# Altium schematic sheet 4layer schematic.SchDoc: Power Bank   by Abdelrahman Ahmed (part 1 of 3)
size A2; Author: Abdelrahman Ahmed; DrawnBy: Abdelrahman Ahmed; Engineer: Abdelrahman Ahmed; Address3: Alexandria; Address4: Egypt; SheetNumber: 1; SheetTotal: 1
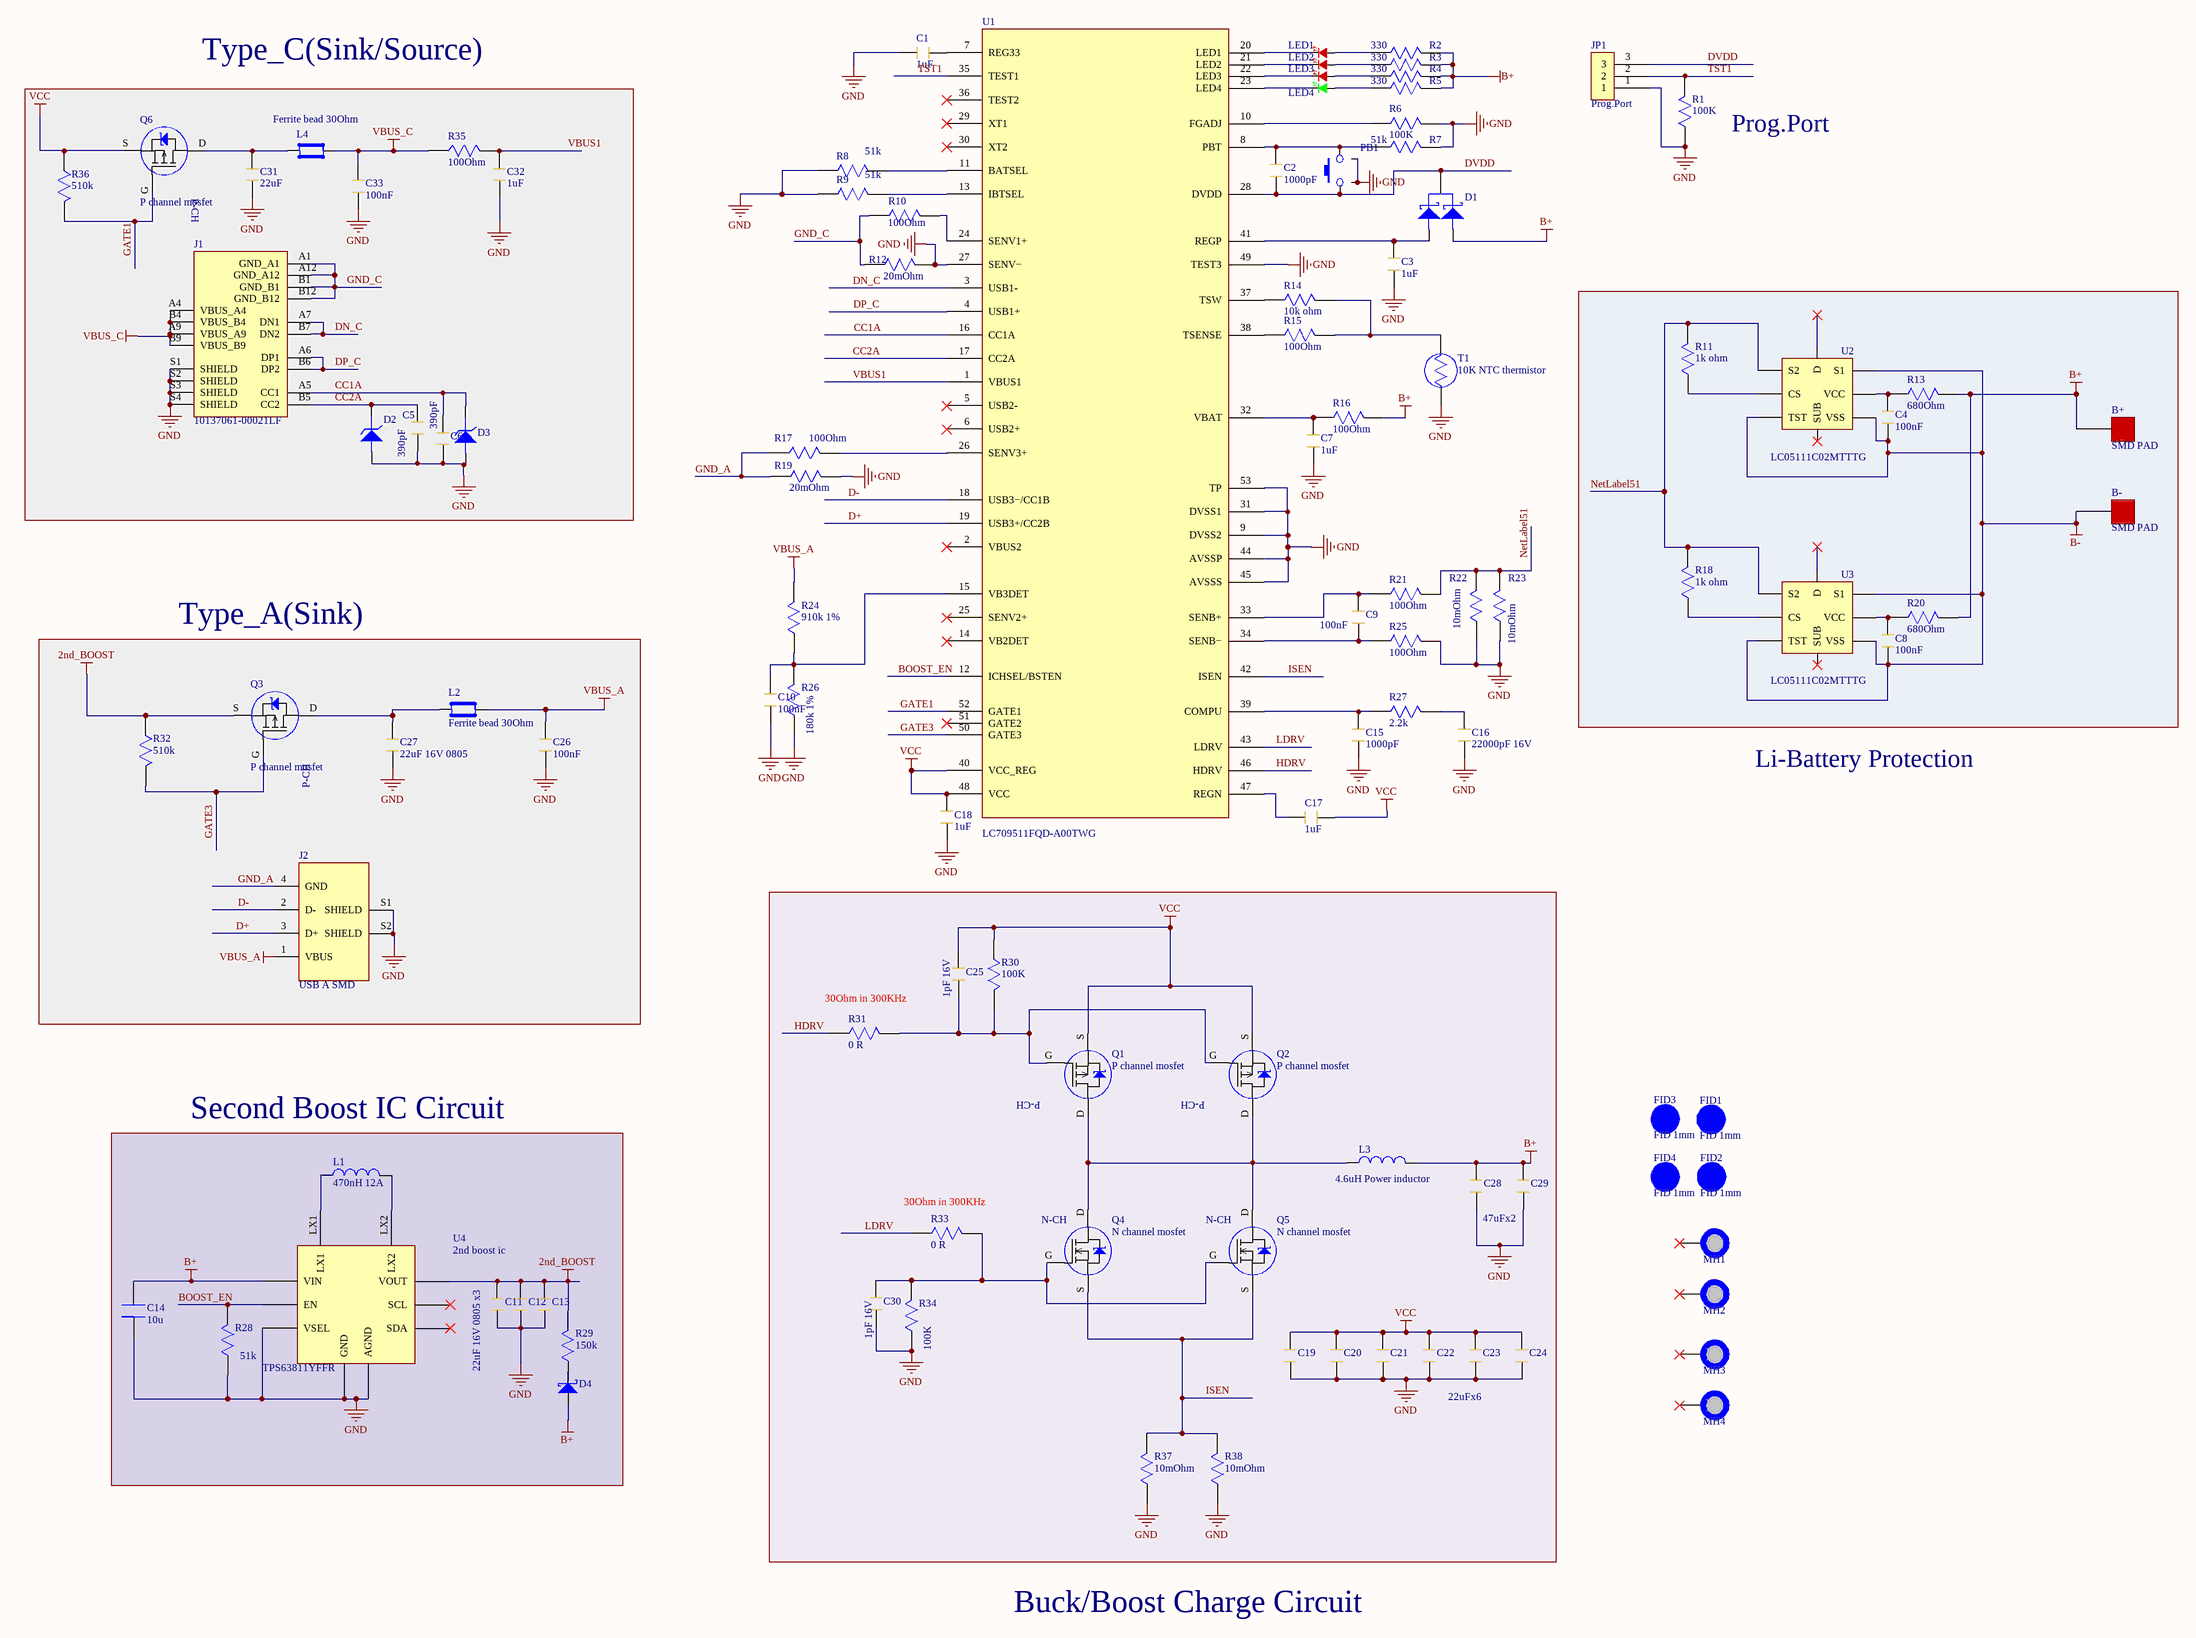
[diagram p0: 4layer schematic.SchDoc]

## Parts
B+  SMD PAD  [SMD PAD]
B-  SMD PAD  [SMD PAD]
C1  1uF  [R0603]
C2  1000pF  [C0402]
C3  1uF  [R0603]
C4  100nF  [C0402]
C5  390pF  [R0603]
C6  390pF  [R0603]
C7  1uF  [R0603]
C8  100nF  [C0402]
C9  100nF  [C0402]
C10  100nF  [C0402]
C11  22uF 16V 0805  [Cap 0805]  (value not drawn)
C12  22uF 16V 0805  [Cap 0805]  (value not drawn)
C13  22uF 16V 0805 x3  [Cap 0805]
C14  10u  [Cap 0805]
C15  1000pF  [C0402]
C16  22000pF 16V  [C0402]
C17  1uF  [R0603]
C18  1uF  [R0603]
C19  22uF 16V 0805  [Cap 0805]  (value not drawn)
C20  22uF 16V 0805  [Cap 0805]  (value not drawn)
C21  22uF 16V 0805  [Cap 0805]  (value not drawn)
C22  22uF 16V 0805  [Cap 0805]  (value not drawn)
C23  22uF 16V 0805  [Cap 0805]  (value not drawn)
C24  22uF 16V 0805  [Cap 0805]  (value not drawn)
C25  1pF 16V  [C0402]
C26  100nF  [Cap 0805]
C27  22uF 16V 0805  [Cap 0805]
C28  47uFx2  [C1210]
C29  47uF 16V  [C1210]  (value not drawn)
C30  1pF 16V  [C0402]
C31  22uF  [Cap 0805]
C32  1uF  [R0603]
C33  100nF  [Cap 0805]
D1  common cathode Schottkey  [3Pins schottkey]  (value not drawn)
D2  zener SOD532 5.1V 10mA  [Zener SOD532]  (value not drawn)
D3  zener SOD532 5.1V 10mA  [Zener SOD532]  (value not drawn)
D4  BAT54HT1G  [diode sfmntd]  (value not drawn)
FID1  FID 1mm  [FID]  (no BOM)
FID2  FID 1mm  [FID]  (no BOM)
FID3  FID 1mm  [FID]  (no BOM)
FID4  FID 1mm  [FID]  (no BOM)
J1  10137061-00021LF  [PCBComponent_1]
J2  USB A SMD  [692122030100]
JP1  Prog.Port  [HDR Male 1x3]
L1  470nH 12A  [inductor 470nH]
L2  Ferrite bead 30Ohm  [R0805]
L3  4.6uH Power inductor  [inductor mouser]
L4  Ferrite bead 30Ohm  [R0805]
LED1  RED SMD  [ORNG LED SMD 1206]  (value not drawn)
LED2  RED SMD  [ORNG LED SMD 1206]  (value not drawn)
LED3  RED SMD  [ORNG LED SMD 1206]  (value not drawn)
LED4  GRN SMD  [GRN SMD LED]  (value not drawn)
MH1  Mount holes  [MH]  (value not drawn)  (no BOM)
MH2  Mount holes  [MH]  (value not drawn)  (no BOM)
MH3  MH. not plated  [MH. not plated]  (value not drawn)  (no BOM)
MH4  MH. not plated  [MH. not plated]  (value not drawn)  (no BOM)
PB1  FSMRA4JH04  [PB Right angle through hole]  (value not drawn)
Q1  P channel mosfet  [ECH8310-TL-H]
Q2  P channel mosfet  [ECH8310-TL-H]
Q3  P channel mosfet  [ECH8310-TL-H]
Q4  N channel mosfet  [Power mosfet on semi]
Q5  N channel mosfet  [Power mosfet on semi]
Q6  P channel mosfet  [ECH8310-TL-H]
R1  100K  [R0805]
R2  330  [R0805]
R3  330  [R0805]
R4  330  [R0805]
R5  330  [R0805]
R6  100K  [R0805]
R7  51k  [R0805]
R8  51k  [R0805]
R9  51k  [R0805]
R10  100Ohm  [R0603]
R11  1k ohm  [R0805]
R12  20mOhm  [R1206]
R13  680Ohm  [R0805]
R14  10k ohm  [R0805]
R15  100Ohm  [R0603]
R16  100Ohm  [R0603]
R17  100Ohm  [R0603]
R18  1k ohm  [R0805]
R19  20mOhm  [R1206]
R20  680Ohm  [R0805]
R21  100Ohm  [R0603]
R22  10mOhm  [R1206]
R23  10mOhm  [R1206]
R24  910k 1%  [R0805]
R25  100Ohm  [R0603]
R26  180k 1%  [R0805]
R27  2.2k  [R0805]
R28  51k  [R0805]
R29  150k  [R0805]
R30  100K  [R0805]
R31  0 R  [R0805]
R32  510k  [R0805]
R33  0 R  [R0805]
R34  100K  [R0805]
R35  100Ohm  [R0603]
R36  510k  [R0805]
R37  10mOhm  [R1206]
R38  10mOhm  [R1206]
T1  10K NTC thermistor  [thermistor]
U1  LC709511FQD-A00TWG  [Quad52]
U2  LC05111C02MTTTG  [LC05111C02MTTTGOSCT]
U3  LC05111C02MTTTG  [LC05111C02MTTTGOSCT]
U4  2nd boost ic  [BGA3x5]

## Blocks framed on the sheet
Type_A(Sink): C26 C27 J2 L2 Q3 R32
Second Boost IC Circuit: C11-C14 D4 L1 R28 R29 U4

## Nets
2nd_BOOST: C11.2 C12.2 C13.2 Q3.S R29.2 R32.2 U4.VOUT
B+: B+.1 C14.2 C28.2 C29.2 D1.2(ANODE2) D4.2(Anode) L3.2 R2.2 R3.2 R4.2 R5.2 R13.2 R16.2 R20.2 U4.VIN
B-: B-.1 C4.1 C8.1 U2.S1 U2.TST U2.VSS U3.S1 U3.TST U3.VSS
GND: C1.1 C3.1 C5.1 C6.1 C7.1 C10.1 C11.1 C12.1 C13.1 C14.1 C15.1 C16.1 C18.1 C19.1 C20.1 C21.1 C22.1 C23.1 C24.1 C26.1 C27.1 C28.1 C29.1 C30.1 C31.1 C32.1 C33.1 D2.2(A) D3.2(A) J1.S1(SHIELD) J1.S2(SHIELD) J1.S3(SHIELD) J1.S4(SHIELD) J2.S1(SHIELD) J2.S2(SHIELD) JP1.1 PB1.3(MH) PB1.4(MH) R1.2 R6.2 R7.2 R8.1 R9.1 R12.2 R19.2 R22.1 R23.1 R25.2 R26.1 R28.1 R34.1 R37.1 R38.1 T1.1 U1.9(DVSS2) U1.27(SENV−) U1.31(DVSS1) U1.44(AVSSP) U1.45(AVSSS) U1.49(TEST3) U1.53(TP) U4.AGND U4.GND U4.VSEL
VBUS_A: C26.2 J2.1(VBUS) L2.1 R24.2
VBUS_C: C33.2 J1.A4(VBUS_A4) J1.A9(VBUS_A9) J1.B4(VBUS_B4) J1.B9(VBUS_B9) L4.1 R35.2
VCC: C17.2 C18.2 C19.2 C20.2 C21.2 C22.2 C23.2 C24.2 C25.2 Q1.S Q2.S Q6.S R30.1 R36.2 U1.40(VCC_REG) U1.48(VCC)
BOOST_EN: R28.2 U1.12(ICHSEL/BSTEN) U4.EN
CC1A: C6.2 D3.1(K) J1.A5(CC1) U1.16(CC1A)
CC2A: C5.2 D2.1(K) J1.B5(CC2) U1.17(CC2A)
D+: J2.3(D+) U1.19(USB3+/CC2B)
D-: J2.2(D-) U1.18(USB3−/CC1B)
DN_C: J1.A7(DN1) J1.B7(DN2) U1.3(USB1-)
DP_C: J1.A6(DP1) J1.B6(DP2) U1.4(USB1+)
DVDD: C2.1 D1.3(Cathode) JP1.3 PB1.1 U1.28(DVDD)
GATE1: Q6.G R36.1 U1.52(GATE1)
GATE3: Q3.G R32.1 U1.50(GATE3)
GND_A: J2.4(GND) R17.1 R19.1
GND_C: J1.A1(GND_A1) J1.A12(GND_A12) J1.B1(GND_B1) J1.B12(GND_B12) R10.1 R12.1
HDRV: R31.1 U1.46(HDRV)
ISEN: Q4.S Q5.S R37.2 R38.2 U1.42(ISEN)
LDRV: R33.1 U1.43(LDRV)
NetLabel51: R11.2 R18.2 R21.2 R22.2 R23.2 U2.S2 U3.S2
TST1: JP1.2 R1.1 U1.35(TEST1)
VBUS1: C32.2 R35.1 U1.1(VBUS1)
NetC1_2: C1.2 U1.7(REG33)
NetC2_2: C2.2 PB1.2 R7.1 U1.8(PBT)
NetC3_2: C3.2 D1.1(ANODE1) U1.41(REGP)
NetC4_2: C4.2 R13.1 U2.VCC
NetC7_2: C7.2 R16.1 U1.32(VBAT)
NetC8_2: C8.2 R20.1 U3.VCC
NetC9_1: C9.1 R25.1 U1.34(SENB−)
NetC9_2: C9.2 R21.1 U1.33(SENB+)
NetC10_2: C10.2 R24.1 R26.2 U1.15(VB3DET)
NetC15_2: C15.2 R27.1 U1.39(COMPU)
NetC16_2: C16.2 R27.2
NetC17_1: C17.1 U1.47(REGN)
NetC25_1: C25.1 Q1.G Q2.G R30.2 R31.2
NetC27_2: C27.2 L2.2 Q3.D
NetC30_2: C30.2 Q4.G Q5.G R33.2 R34.2
NetC31_2: C31.2 L4.2 Q6.D
NetD4_1: D4.1(cat) R29.1
NetL1_1: L1.1 U4.LX1
NetL1_2: L1.2 U4.LX2
NetL3_1: L3.1 Q1.D Q2.D Q4.D Q5.D
NetLED1_1: LED1.1(Cathode) U1.20(LED1)
NetLED1_2: LED1.2(Anode) R2.1
NetLED2_1: LED2.1(Cathode) U1.21(LED2)
NetLED2_2: LED2.2(Anode) R3.1
NetLED3_1: LED3.1(Cathode) U1.22(LED3)
NetLED3_2: LED3.2(Anode) R4.1
NetLED4_1: LED4.1(Cathode) U1.23(LED4)
NetLED4_2: LED4.2(Anode) R5.1
NetR6_1: R6.1 U1.10(FGADJ)
NetR8_2: R8.2 U1.11(BATSEL)
NetR9_2: R9.2 U1.13(IBTSEL)
NetR10_2: R10.2 U1.24(SENV1+)
NetR11_1: R11.1 U2.CS
NetR14_1: R14.1 U1.37(TSW)
NetR14_2: R14.2 R15.2 T1.2
NetR15_1: R15.1 U1.38(TSENSE)
NetR17_2: R17.2 U1.26(SENV3+)
NetR18_1: R18.1 U3.CS

Not connected (* = marked no-connect by the designer): MH1 1*; MH2 1*; MH3 1*; MH4 1*; U1 2(VBUS2)* 5(USB2-)* 6(USB2+)* 14(VB2DET)* 25(SENV2+)* 29(XT1)* 30(XT2)* 36(TEST2)* 51(GATE2)*; U2 D* SUB*; U3 D* SUB*; U4 SCL* SDA*

## Notes on the sheet
- Type_C(Sink/Source)
- (near R1) Prog.Port
- Li-Battery Protection
- (near R31) 30Ohm in 300KHz
- (near R33) 30Ohm in 300KHz
- 22uFx6
- Buck/Boost Charge Circuit
- Title
- Size:
- Date:
- File:
- A2
- Number:
- Time:
- Revision:
- Sheet
- of
- (in symbol ECH8310-TL-H) P-CH
- (in symbol NTTFS4H05NTAG) N-CH